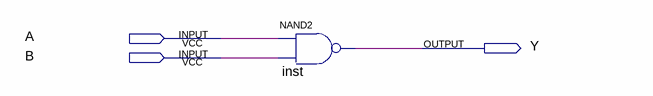
[diagram p0: schematic sheet]
// Quartus schematic CONG_NAND.bdf as structural Verilog: 1 symbols, 3 pins
module CONG_NAND (
  input  A,
  input  B,
  output Y
);

  nand inst (Y, A, B);
endmodule
